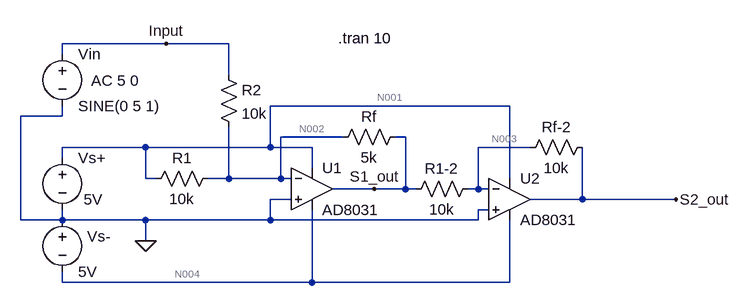
[diagram p0: schematic amplifier.asc]
amplifier.asc, the LTspice schematic file:
Version 4
SHEET 1 880 680
WIRE -560 -80 -720 -80
WIRE -464 -80 -560 -80
WIRE -720 -64 -720 -80
WIRE -464 -32 -464 -80
WIRE -32 16 -400 16
WIRE -720 32 -720 16
WIRE -720 32 -784 32
WIRE -288 64 -384 64
WIRE -192 64 -208 64
WIRE -592 80 -720 80
WIRE -400 80 -400 16
WIRE -400 80 -592 80
WIRE -336 80 -400 80
WIRE 0 80 -80 80
WIRE -720 96 -720 80
WIRE -336 112 -336 80
WIRE -592 128 -592 80
WIRE -576 128 -592 128
WIRE -464 128 -464 48
WIRE -464 128 -496 128
WIRE -384 128 -384 64
WIRE -384 128 -464 128
WIRE -368 128 -384 128
WIRE -32 128 -32 16
WIRE -240 144 -304 144
WIRE -192 144 -192 64
WIRE -192 144 -240 144
WIRE -176 144 -192 144
WIRE -80 144 -80 80
WIRE -80 144 -96 144
WIRE -64 144 -80 144
WIRE -368 160 -400 160
WIRE 80 160 80 80
WIRE 80 160 0 160
WIRE 224 160 80 160
WIRE -64 176 -80 176
WIRE -784 192 -784 32
WIRE -720 192 -720 176
WIRE -720 192 -784 192
WIRE -592 192 -720 192
WIRE -400 192 -400 160
WIRE -400 192 -592 192
WIRE -80 192 -80 176
WIRE -80 192 -400 192
WIRE -592 224 -592 192
WIRE -720 288 -720 272
WIRE -336 288 -336 176
WIRE -336 288 -720 288
WIRE -32 288 -32 192
WIRE -32 288 -336 288
FLAG -592 224 0
FLAG -560 -80 Input
FLAG -240 144 S1_out
FLAG 224 160 S2_out
SYMBOL voltage -720 80 R0
WINDOW 3 33 80 Left 2
SYMATTR Value 5V
SYMATTR InstName Vs+
SYMBOL Opamps\\AD8031 -336 80 R0
SYMATTR InstName U1
SYMBOL res -304 80 R270
WINDOW 0 32 56 VTop 2
WINDOW 3 0 56 VBottom 2
SYMATTR InstName Rf
SYMATTR Value 5k
SYMBOL res -480 112 R90
WINDOW 0 0 56 VBottom 2
WINDOW 3 32 56 VTop 2
SYMATTR InstName R1
SYMATTR Value 10k
SYMBOL voltage -720 -80 R0
WINDOW 123 44 57 Left 2
WINDOW 39 0 0 Left 2
SYMATTR Value2 AC 5 0
SYMATTR InstName Vin
SYMATTR Value SINE(0 5 1)
SYMBOL res -480 -48 R0
SYMATTR InstName R2
SYMATTR Value 10k
SYMBOL voltage -720 176 R0
WINDOW 0 38 41 Left 2
SYMATTR InstName Vs-
SYMATTR Value 5V
SYMBOL res -80 128 R90
WINDOW 0 0 56 VBottom 2
WINDOW 3 32 56 VTop 2
SYMATTR InstName R1-2
SYMATTR Value 10k
SYMBOL Opamps\\AD8031 -32 96 R0
SYMATTR InstName U2
SYMBOL res -16 96 R270
WINDOW 0 32 56 VTop 2
WINDOW 3 0 56 VBottom 2
SYMATTR InstName Rf-2
SYMATTR Value 10k
TEXT -296 -88 Left 2 !.tran 10

The netlist it stands for:
* amplifier.asc
Vs+ N001 0 5V
XU1 0 N002 N001 N004 S1_out AD8031  ; pins In+ In- V+ V- OUT
Rf N002 S1_out 5k
R1 N002 N001 10k
Vin Input 0 SINE(0 5 1) AC 5 0
R2 Input N002 10k
Vs- 0 N004 5V
R1-2 N003 S1_out 10k
XU2 0 N003 N001 N004 S2_out AD8031  ; pins In+ In- V+ V- OUT
Rf-2 N003 S2_out 10k
.tran 10
.backanno
.end

* Results of the author's LTspice run, read from the files saved beside the schematic
* Operating Point, zero values left out:
*   V(n001) = 5 V
*   V(n002) = -737.8 µV
*   V(s1_out) = -2.499 V
*   V(n004) = -5 V
*   V(n003) = -1.254 mV
*   V(s2_out) = 2.501 V
*   I(Rf-2) = -250.2 µA
*   I(R1-2) = 249.8 µA
*   I(R2) = 73.78 nA
*   I(R1) = -500.1 µA
*   I(Rf) = 499.7 µA
*   I(Vs-) = -1.399 mA
*   I(Vin) = -73.78 nA
*   I(Vs+) = -900.8 µA
*   Ix(u1:1) = 474.4 nA
*   Ix(u1:2) = 425.6 nA
*   Ix(u1:99) = -299.5 µA
*   Ix(u1:50) = -1.2 mA
*   Ix(u1:61) = 749.5 µA
*   Ix(u2:1) = 475.6 nA
*   Ix(u2:2) = 424.4 nA
*   Ix(u2:99) = 700.2 µA
*   Ix(u2:50) = -199.8 µA
*   Ix(u2:61) = -250.2 µA
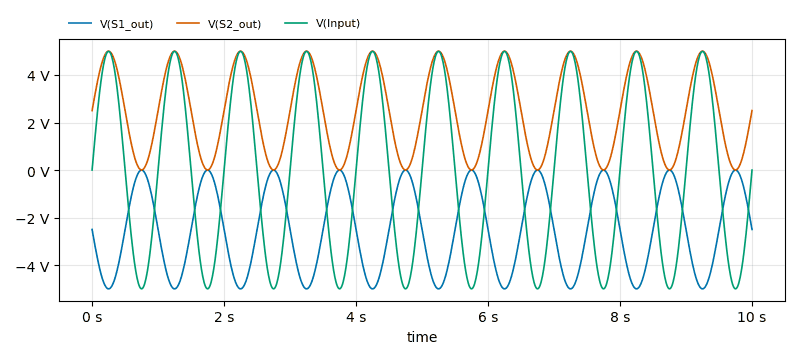
[diagram p1: Transient Analysis of amplifier.asc, plotted from the saved traces]
* Transient Analysis, 1 run:
*   V(S1_out): min -4.996 V, max -2.259 mV, average -2.499 V, rms 3.06 V, last -2.499 V
*   V(S2_out): min 4.508 mV, max 4.998 V, average 2.501 V, rms 3.062 V, last 2.501 V
*   V(Input): min -4.995 V, max 4.995 V, average -133.3 µV, rms 3.534 V, last 0 V